# EAGLE design DACv3-Controller (EAGLE 6.1)
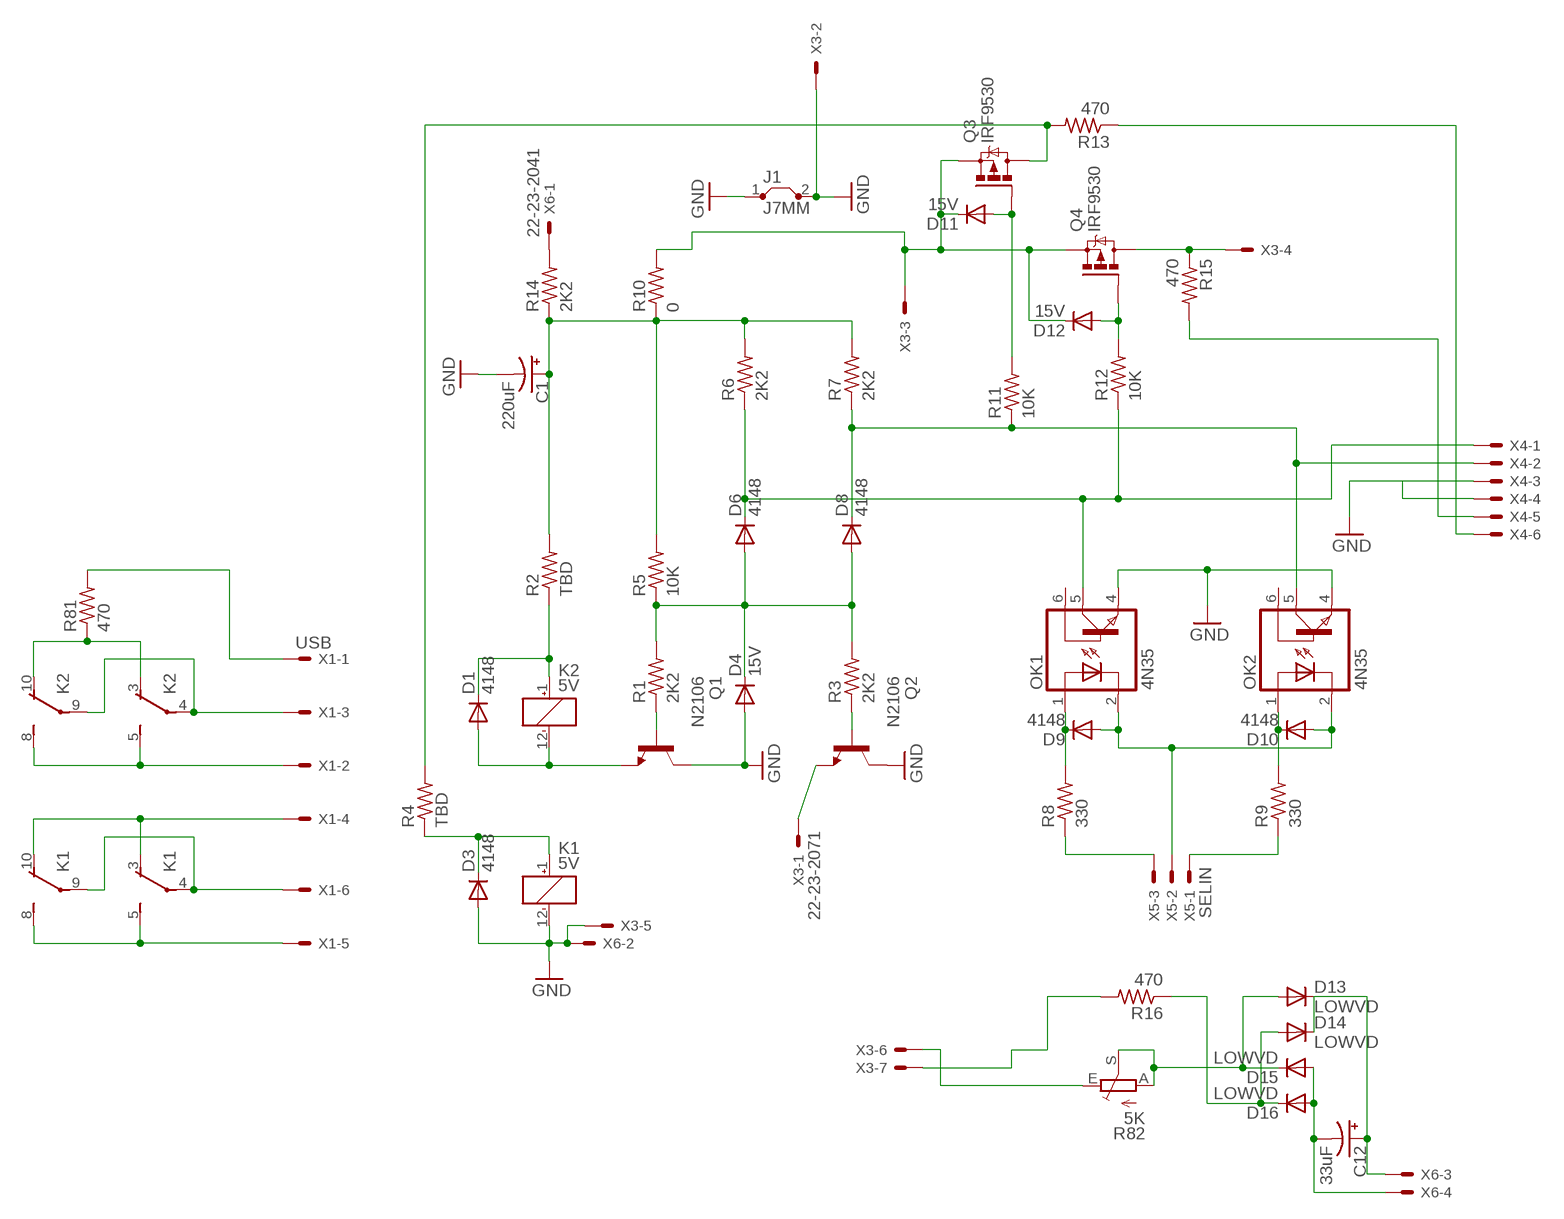
[diagram p0: schematic, sheet 1]

## Parts
C1  220uF  CPOL-USE5-10.5  [E5-10,5]
C12  33uF  CPOL-USTAP5-60  [TAP5-60]
D1  4148  1N4148DO35-7  [DO35-7]
D3  4148  1N4148DO35-7  [DO35-7]
D4  15V  1N4148DO35-7  [DO35-7]
D6  4148  1N4148DO35-7  [DO35-7]
D8  4148  1N4148DO35-7  [DO35-7]
D9  4148  1N4148DO35-7  [DO35-7]
D10  4148  1N4148DO35-7  [DO35-7]
D11  15V  1N4148DO35-7  [DO35-7]
D12  15V  1N4148DO35-7  [DO35-7]
D13  LOWVD  1N4148DO35-7  [DO35-7]
D14  LOWVD  1N4148DO35-7  [DO35-7]
D15  LOWVD  1N4148DO35-7  [DO35-7]
D16  LOWVD  1N4148DO35-7  [DO35-7]
J1  J7MM  [07]
K1  5V  TX2-12V  [TX2]
K2  5V  TX2-12V  [TX2]
OK1  4N35  [DIL06]
OK2  4N35  [DIL06]
Q1  N2106  BC550B  [TO92-EBC]
Q2  N2106  BC550B  [TO92-EBC]
Q3  IRF9530  [TO220BV]
Q4  IRF9530  [TO220BV]
R1  2K2  R-US_0207/10  [0207/10]
R2  TBD  R-US_0207/10  [0207/10]
R3  2K2  R-US_0207/10  [0207/10]
R4  TBD  R-US_0207/10  [0207/10]
R5  10K  R-US_0207/10  [0207/10]
R6  2K2  R-US_0207/10  [0207/10]
R7  2K2  R-US_0207/10  [0207/10]
R8  330  R-US_0207/10  [0207/10]
R9  330  R-US_0207/10  [0207/10]
R10  0  R-US_0207/12  [0207/12]
R11  10K  R-US_0207/10  [0207/10]
R12  10K  R-US_0207/10  [0207/10]
R13  470  R-US_0207/10  [0207/10]
R14  2K2  R-US_0207/12  [0207/12]
R15  470  R-US_0207/10  [0207/10]
R16  470  R-US_0207/10  [0207/10]
R81  470  R-US_0207/10  [0207/10]
R82  5K  TRIM_EU-RJ9W  [RJ9W]
X1  USB  22-23-2061  [22-23-2061]
X3  22-23-2071  [22-23-2071]
X4  22-23-2061  [22-23-2061]
X5  SELIN  22-23-2031  [22-23-2031]
X6  22-23-2041  [22-23-2041]

## Nets
GND: C1.- D3.A D4.A J1.1 J1.2 K1.12(_:-) OK1.4(EMI) OK2.4(EMI) Q1.C Q2.C X3.2 X3.5 X4.3 X4.4 X6.2
N$1: K2.4(1:P) K2.9(2:P) X1.3
N$2: K2.3(1:O) K2.10(2:O) R81.1
N$3: K2.5(1:S) K2.8(2:S) X1.2
N$4: R81.2 X1.1
N$5: K1.4(1:P) K1.9(2:P) X1.6
N$6: K1.3(1:O) K1.10(2:O) X1.4
N$7: K1.5(1:S) K1.8(2:S) X1.5
N$8: D3.C K1.1(_:+) R4.1
N$9: R8.1 X5.3
N$10: D1.A K2.12(_:-) Q1.E
N$11: D1.C K2.1(_:+) R2.1
N$12: Q1.B R1.1
N$13: Q2.B R3.1
N$14: D4.C D6.A D8.A R1.2 R3.2 R5.1
N$15: Q2.E X3.1
N$16: D6.C OK1.5(COL) R6.1 R12.1 X4.1
N$17: D8.C OK2.5(COL) R7.1 R11.1 X4.2
N$18: C1.+ R2.2 R5.2 R6.2 R7.2 R10.1 R14.1
N$19: D9.A D10.A OK1.2(C) OK2.2(C) X5.2
N$20: D10.C OK2.1(A) R9.2
N$21: D9.C OK1.1(A) R8.2
N$22: R9.1 X5.1
N$23: D11.A Q3.G R11.2
N$24: D12.A Q4.G R12.2
N$25: D11.C D12.C Q3.S Q4.S R10.2 X3.3
N$26: Q3.D R4.2 R13.2
N$27: Q4.D R15.1 X3.4
N$28: R15.2 X4.5
N$29: R13.1 X4.6
N$30: R82.E X3.6
N$31: R16.2 X3.7
N$32: D14.A D16.C R16.1
N$33: D13.A D15.C R82.A R82.S
N$36: R14.2 X6.1
N$37: C12.- D15.A D16.A X6.4
N$38: C12.+ D13.C D14.C X6.3
Unconnected: OK1.6(BAS) OK2.6(BAS)

## Library data of the parts
C1 C12 = resistor:CPOL-US: POLARIZED CAPACITOR, American symbol
D1 D3 D4 D6 D8-D16 = diode:1N4148: DIODE high speed (Philips)
J1 = jumper:J: Bridge
K1 K2 = relay:TX2?-*: 2 AMP. HIGH CAPACITY RELAY NAiS WITH HIGH SURGE VOLTAGE & HIGH BREAKDOWN VOLTAGE Source: http://www.mew-europe.com/.. en_ds_61022_0001.pdf; MF: AROMAT/ MATSUSHITA; MPN: TX2-12V; OC_FARNELL: 1200952; OC_NEWARK: 67K1295
OK1 OK2 = optocoupler:4N35: MOTOROLA OPTO COUPLER; MF: FAIRCHILD SEMICONDUCTOR; MPN: 4N35; OC_FARNELL: 1328375; OC_NEWARK: 72K9946
Q1 Q2 = transistor-npn:BC550*: NPN Transistor
Q3 Q4 = transistor-power:IRF9530: P-CHANNEL HEXFET POWER-MOS-FET Source: http://www.irf.com/product-info/datasheets/data/irf9530.pdf
R1-R16 R81 = resistor:R-US_: RESISTOR, American symbol
R82 = pot:TRIM_EU-: POTENTIOMETER
X1 X4 = con-molex:22-23-2061: .100" (2.54mm) Center Header - 6 Pin; MF: MOLEX; MPN: 22-23-2061; OC_FARNELL: 1462922; OC_NEWARK: 27C1933
X3 = con-molex:22-23-2071: .100" (2.54mm) Center Header - 7 Pin; MF: MOLEX; MPN: 22-23-2071; OC_FARNELL: 1654534; OC_NEWARK: 56H0445
X5 = con-molex:22-23-2031: .100" (2.54mm) Center Header - 3 Pin; MF: MOLEX; MPN: 22-23-2031; OC_FARNELL: 1462950; OC_NEWARK: 30C0862
X6 = con-molex:22-23-2041: .100" (2.54mm) Center Header - 4 Pin; MF: MOLEX; MPN: 22-23-2041; OC_FARNELL: 1462920; OC_NEWARK: 38C0355

## Board
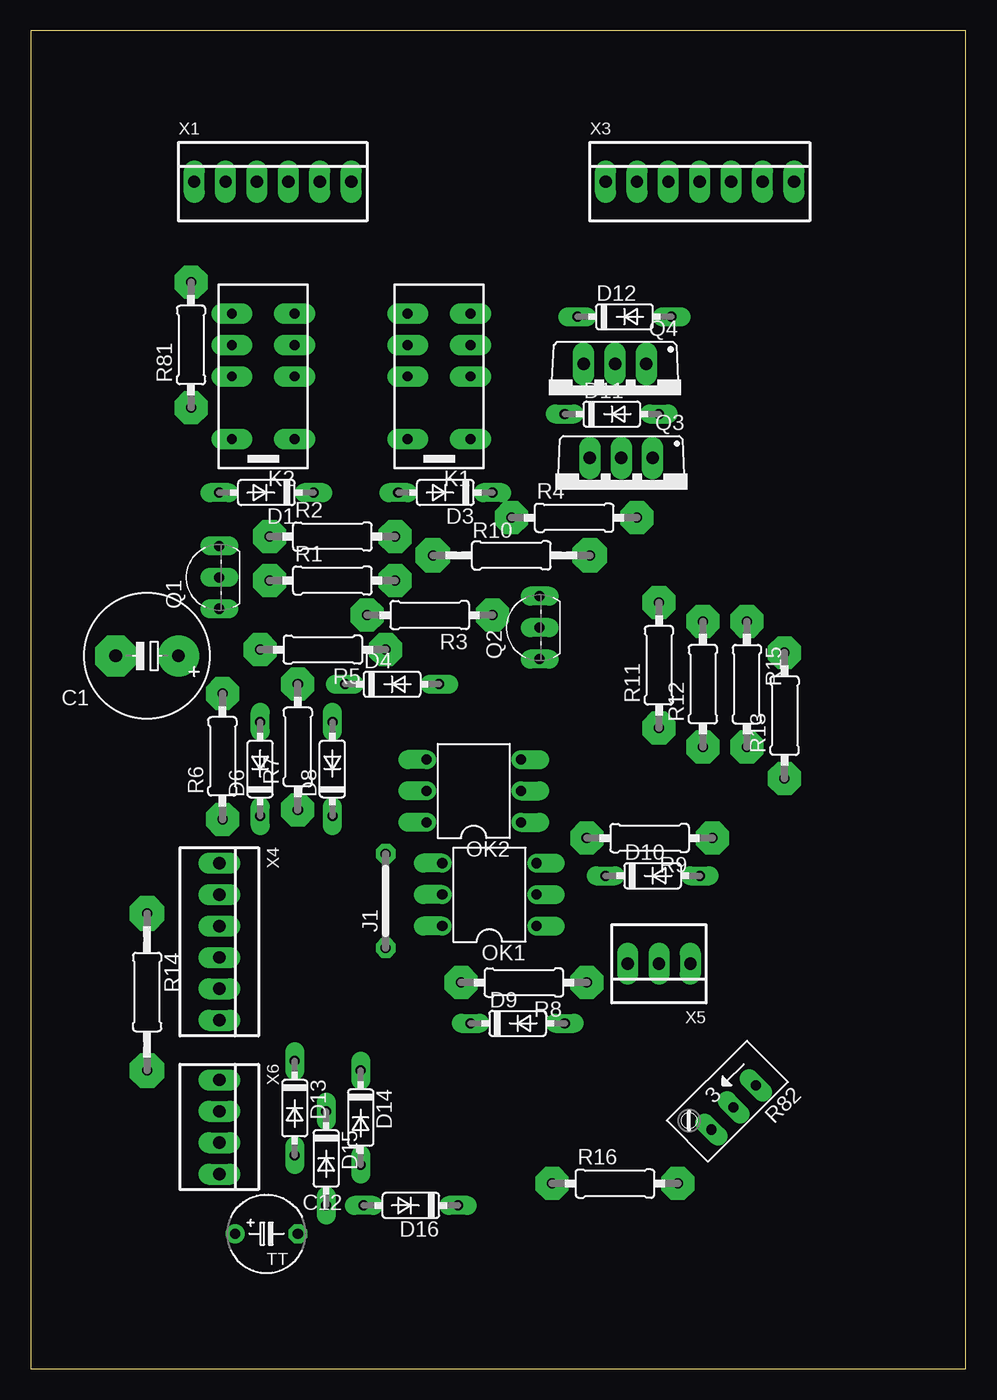
[diagram p1: board, top side]
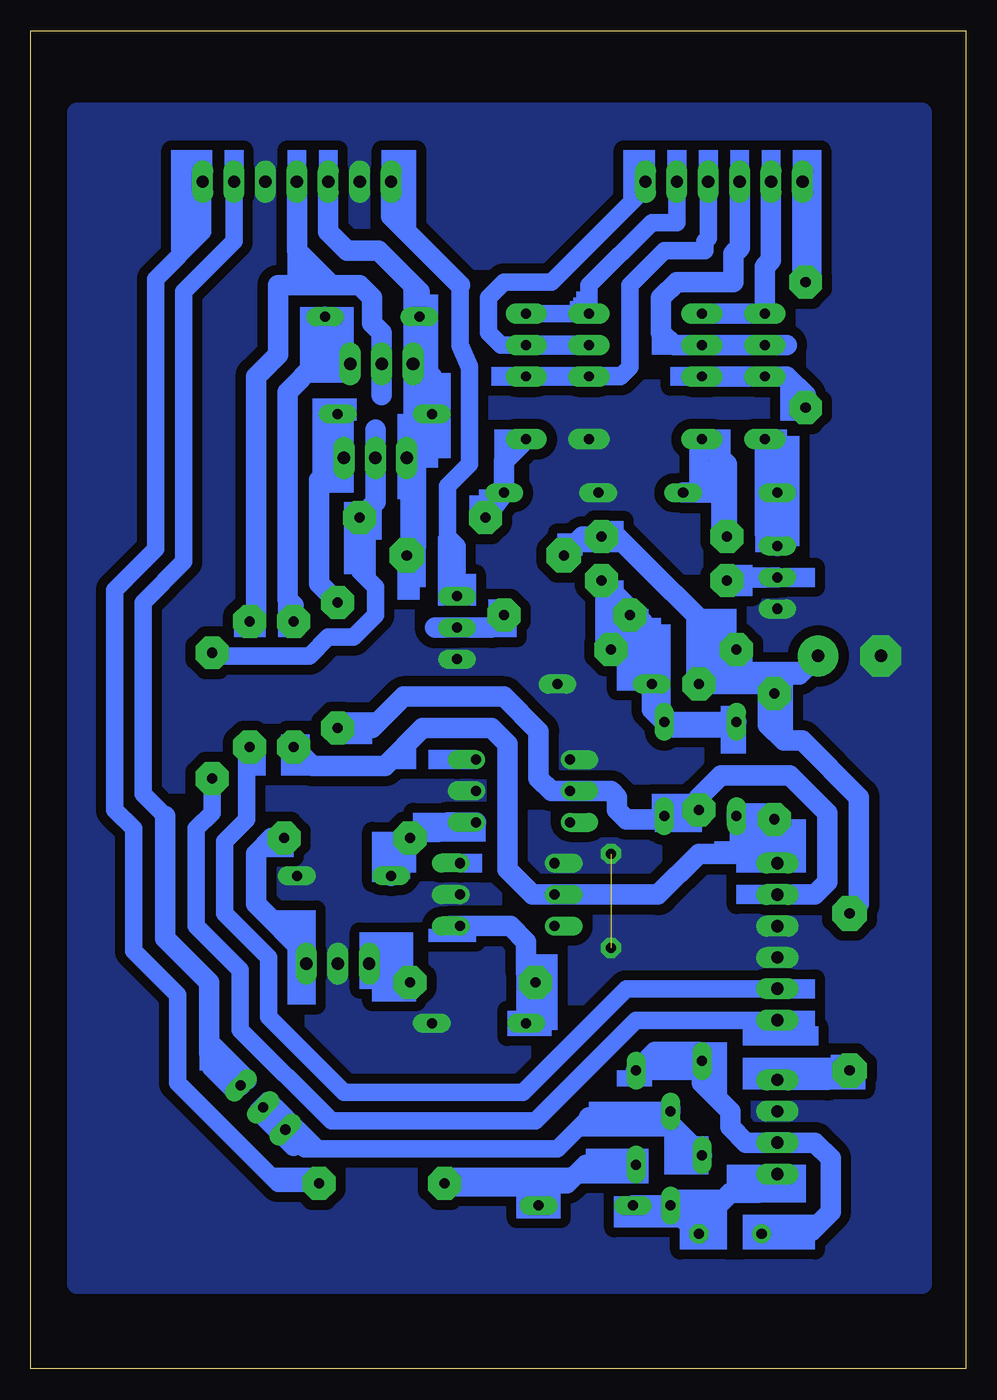
[diagram p2: board, bottom side, seen from below]

Size 75.62 x 108.18 mm. Coordinates in mm from the lower left corner, seen from the top.
Outline: 0,108.18 0,0 75.62,0 75.62,108.18 0,108.18
Copper layers (1*16): Top 0.035mm / dielectric 1.5mm / Bottom 0.035mm
Design rules: minimum track width 10mil, minimum drill 24mil, track to track 8mil, track to pad 8mil, pad to pad 8mil, via to via 8mil, smd to smd 8mil, copper to edge 40mil, drill to drill 8mil, minimum pad ring 14mil, minimum via ring 8mil, stop-mask expansion 4mil, vias tented up to drill 0mil, thermal gap 10mil

### Footprints (pad centres in the part's own frame; a part is rotated, then mirrored left to right if it is on the bottom)
E5-10,5 = drill 1.016 pad 3.302: + -2.54,0 | drill 1.016 pad 3.302 octagon: - 2.54,0
TAP5-60 = drill 0.813: + -2.54,0 | drill 0.813 octagon: - 2.54,0
DO35-7 = drill 0.813 long: A 3.81,0; C -3.81,0
07 = drill 0.813 pad 1.6 octagon: 1 -3.81,0; 2 3.81,0
TX2 = drill 0.8 pad 1.676 long: 1 -5.08,-2.54; 3 0,-2.54; 4 2.54,-2.54; 5 5.08,-2.54; 8 5.08,2.54; 9 2.54,2.54; 10 0,2.54; 12 -5.08,2.54
DIL06 = drill 0.813 offset: 1 -2.54,-3.81; 2 0,-3.81; 3 2.54,-3.81; 4 2.54,3.81; 5 0,3.81; 6 -2.54,3.81
TO92-EBC = drill 0.813 long: B 0,-1.27; C -2.54,-1.27; E 2.54,-1.27
TO220BV = drill 1.016 long: D 0,-2.54; G -2.54,-2.54; S 2.54,-2.54
0207/10 = drill 0.813 pad 2.667 octagon: 1 -5.08,0; 2 5.08,0
0207/12 = drill 0.813 pad 2.794 octagon: 1 -6.35,0; 2 6.35,0
RJ9W = drill 0.813 long: A 2.54,0.635; E -2.54,0.635; S 0,0.635
22-23-2061 = drill 1 long: 1 -6.35,0; 2 -3.81,0; 3 -1.27,0; 4 1.27,0; 5 3.81,0; 6 6.35,0
22-23-2071 = drill 1 long: 1 -7.62,0; 2 -5.08,0; 3 -2.54,0; 4 0,0; 5 2.54,0; 6 5.08,0; 7 7.62,0
22-23-2031 = drill 1 long: 1 -2.54,0; 2 0,0; 3 2.54,0
22-23-2041 = drill 1 long: 1 -3.81,0; 2 -1.27,0; 3 1.27,0; 4 3.81,0

### Placement (x,y rotation side)
C1  9.4,57.64 180 top
C12  19.05,10.9 0 top
D1  19.05,70.85 180 top
D3  33.53,70.85 180 top
D4  29.21,55.35 0 top
D6  18.54,48.49 90 top
D8  24.38,48.49 90 top
D9  39.37,27.92 0 top
D10  50.29,39.86 0 top
D11  46.99,77.2 0 top
D12  48.01,85.07 0 top
D13  21.34,21.06 270 top
D14  26.67,20.3 270 top
D15  23.88,17 270 top
D16  30.73,13.19 180 top
J1  28.7,37.83 90 top
K1  33.02,80.24 90 top
K2  18.8,80.24 90 top
OK1  37.08,38.33 90 top
OK2  35.81,46.72 90 top
Q1  13.97,63.99 90 top
Q2  39.88,59.92 90 top
Q3  47.75,71.1 180 top
Q4  47.24,78.72 180 top
R1  24.38,63.73 0 top
R2  24.38,67.29 0 top
R3  32.26,60.94 180 top
R4  43.94,68.81 0 top
R5  23.62,58.15 180 top
R6  15.49,49.51 90 top
R7  21.59,50.27 90 top
R8  39.88,31.22 180 top
R9  50.04,42.91 180 top
R10  38.86,65.77 0 top
R11  50.8,56.88 90 top
R12  54.36,55.35 90 top
R13  60.96,52.81 90 top
R14  9.4,30.46 270 top
R15  57.91,55.35 270 top
R16  47.24,14.97 0 top
R81  12.95,82.78 90 top
R82  56.39,21.57 224.8 top
X1  19.56,95.99 0 top
X3  54.1,95.99 0 top
X4  15.24,34.52 270 top
X5  50.8,32.75 180 top
X6  15.24,19.54 270 top

### Tracks (layer width: path | path; a pad name or v marks a point on that pad's centre or on a via)
GND  (1 unrouted)
  pour Bottom (isolate 0.813, no thermals): 71.88,101.58 3.56,101.58 3.56,6.84 71.88,6.84
N$1
  Bottom 1.676: K2.9 14.48,82.78 | K2.9 K2.4 | K2.9 23.62,82.78 24.64,83.8 24.64,86.59 23.37,87.86 18.8,87.86 18.8,90.15 18.29,90.66 X1.3 18.29,96.25
N$2
  Bottom 1.676: R81.1 12.95,78.72 14.48,80.24 K2.10 K2.3
N$3
  Bottom 1.676: 15.75,96.25 X1.2 15.75,89.64 16.26,89.13 K2.8 K2.5
N$4
  Bottom 1.676: 13.21,96.25 X1.1 13.21,88.12 R81.2
N$5
  Bottom 1.422: X1.6 25.91,95.48 33.53,87.86 37.34,87.86 38.61,86.59 38.61,83.8 37.59,82.78 K1.4 K1.9
N$6
  Bottom 1.422: X1.4 20.83,91.42 21.08,91.17 21.08,90.4 24.38,90.4 27.18,87.61 27.18,81.01 27.94,80.24 K1.10 K1.3
N$7
  Bottom 1.422: X1.5 23.37,92.69 25.4,92.69 30.48,87.61 K1.8 K1.5
N$8
  Bottom 1.676: R4.1 D3.C 37.34,73.39 K1.1
N$9
  Bottom 1.676: R8.1 46.48,32.75 X5.3
N$10
  Bottom 1.676: 16.26,70.85 K2.12 | D1.A 16.26,70.85 | 16.26,70.85 16.26,67.54 Q1.E
N$11
  Bottom 1.676: R2.1 19.3,70.85 | 19.3,70.85 19.3,73.13 K2.1 | D1.C 19.3,70.85
N$12
  Bottom 1.676: R1.1 19.05,63.99 Q1.B
N$13
  Bottom 1.422: R3.1 38.35,59.92
  Bottom 1.676: 38.35,59.92 Q2.B 42.93,59.92
N$14
  Bottom 1.676: R1.2 26.16,60.43 | R3.2 26.16,60.43 | 26.16,60.43 26.16,58.15 | 26.16,58.15 26.16,56.62 25.4,55.86 D4.C 25.4,53.32 D8.A D6.A | R5.1 26.16,58.15
N$15
  Bottom 1.422: Q2.E 41.15,66.53 41.91,67.29 41.91,71.35 40.13,73.13 40.13,81.01 40.89,82.78 40.89,87.61
  Bottom 1.676: 40.89,87.61 46.48,93.2 X3.1
N$16
  Bottom 1.676: 18.29,44.68 15.75,44.68 R6.1 15.24,44.18 X4.1 | 18.29,44.68 D6.C 18.29,44.43 | 18.29,44.43 18.29,42.14 18.8,41.64 21.59,41.64 24.89,38.33 OK1.5 35.05,38.33 37.08,40.37 37.08,50.53 38.35,51.8 43.94,51.8 46.99,48.75 52.83,48.75 R12.1 | 18.29,44.43 18.29,44.68
N$17
  Bottom 1.676: R7.1 22.1,44.68 D8.C 24.64,44.43 27.43,44.43 28.19,45.19 28.19,46.21 28.7,46.72 OK2.5 33.53,46.72 34.54,47.73 34.54,51.54 37.34,54.34 45.47,54.34 48.01,51.8 R11.1 | X4.2 12.19,38.33 11.18,39.35 11.18,44.94 14.22,47.99 19.81,47.99 21.59,46.21 R7.1 | 21.59,44.94 R7.1
N$18
  Bottom 1.676: R6.2 16.26,55.35 18.54,55.35 | 18.54,55.35 R7.2 | 18.54,55.35 R5.2 19.05,58.15 28.19,67.29 R2.2 30.99,67.29 R10.1 | 16,54.59 16,52.05 14.73,50.78 13.21,50.78 8.64,46.21 8.64,37.57 R14.1 | 16,54.59 16,55.35 | R6.2 16,54.59 | C1.+ 13.46,56.11 18.29,56.11 17.53,55.35 16,55.35 | 16,55.35 15.49,54.84 R6.2
N$19
  pour Bottom (isolate 0.813, no thermals): 40.89,50.27 56.64,50.27 56.64,23.86 33.27,23.86 38.1,50.53 40.89,50.53
N$20
  Bottom 1.676: OK2.1 41.91,44.18 42.67,43.41 44.45,43.41 R9.2 46.48,41.38 D10.C
N$21
  Bottom 1.676: D9.C 34.8,28.68 R8.2 35.56,31.98 35.56,34.52 36.83,35.79 OK1.1 41.66,35.79
N$22
  Bottom 1.676: R9.1 56.13,42.91 57.4,41.64 57.4,37.57 53.34,33.51 X5.1
N$23
  Bottom 1.676: R11.2 52.32,63.48 52.32,71.86 Q3.G 50.8,74.15 D11.A
N$24
  Bottom 1.676: R12.2 54.36,61.7 54.86,62.21 54.86,78.97 52.58,81.26 51.82,81.26 | 51.82,81.26 Q4.G | D12.A 51.82,81.26
N$25
  Bottom 1.676: 44.45,73.64 44.45,66.53 R10.2 45.47,65.51 | 44.45,73.64 44.45,74.4 43.18,75.67 D11.C 43.18,80.24 44.2,81.26 | 44.2,81.26 D12.C 44.2,87.1 47.5,90.4 50.04,90.4 51.56,91.93 X3.3 | Q4.S 44.2,81.26 | Q3.S 44.45,73.64
N$26
  Bottom 1.422: R4.2 49.02,64.5 47.75,63.23 47.75,60.94 49.53,59.16 51.56,59.16 53.09,57.64 60.45,57.64 60.71,57.89 R13.2
  Bottom 1.676: R4.2 47.75,70.08 Q3.D 47.75,75.93
N$27
  Bottom 1.676: 47.24,78.72 Q4.D 47.24,83.8 48.01,84.56 48.01,86.59 49.02,87.61 51.31,87.61 | 51.31,87.61 54.1,90.4 X3.4 | 51.31,87.61 55.63,87.61 55.63,82.02 57.4,80.24 57.4,60.94 R15.1
N$28
  Bottom 1.422: X4.5 27.43,30.71 35.81,22.33 50.29,22.33 56.39,28.43 56.39,33.25 59.94,36.81 59.94,42.65 58.17,44.43 58.17,50.02 R15.2
N$29
  Bottom 1.422: X4.6 26.67,28.17 34.8,20.05 51.31,20.05 58.67,27.41 58.67,32.24 62.23,35.79 62.23,43.67 60.96,44.94 R13.1
N$30
  Bottom 1.422: 64.77,44.68 66.55,46.46 66.55,61.96 63.25,65.26 63.25,87.1 59.18,91.17 X3.6 59.18,96.25
  Bottom 1.676: R82.E 61.21,25.48 61.21,31.22 64.77,34.78 64.77,44.68
N$31
  Bottom 1.422: R16.2 55.63,14.97 63.75,23.09 63.75,30.21 67.31,33.76 67.31,43.67 68.83,45.19 68.83,62.97 65.53,66.27 65.53,88.12 61.72,91.93 X3.7
N$32
  Bottom 1.676: D14.A 30.73,16.49 32.26,14.97 34.54,14.97 | 34.54,14.97 R16.1 | D16.C 34.54,14.97
N$33
  Bottom 1.422: R82.S 55,19.28 | R82.A 53.46,17.76 33.02,17.76 30.48,20.3
  Bottom 1.676: 55,19.28 54.86,19.28 54.91,19.33 R82.A | D13.A 24.26,20.17 | 24.26,20.17 24.38,20.3 30.48,20.3 | 23.88,21.06 D15.C 24.26,20.43 24.26,20.17
N$34
  Bottom 1.676: 52.83,18.01 56.39,21.57 57.15,20.81 54.36,18.01 55.12,19.28
N$35
  Bottom 1.676: 58.17,23.35 60.96,26.14 60.96,24.36 59.18,22.59
N$36
  Bottom 1.676: R14.2 11.18,23.35 X6.1
N$37
  Bottom 1.676: C12.- 21.97,11.28 | 21.97,11.28 D15.A D16.A | X6.4 16.76,14.2 19.05,14.2 21.97,11.28
N$38
  Bottom 1.676: C12.+ 16.26,11.16 12.45,11.16 10.92,12.68 10.92,17 12.19,18.27 X6.3 17.78,18.27 19.05,19.54 19.05,20.81 21.34,23.09 D13.C 21.34,25.38 21.59,25.63 25.15,25.63 D14.C
(copper drawn outside any net)
  shapes: Bottom area x193